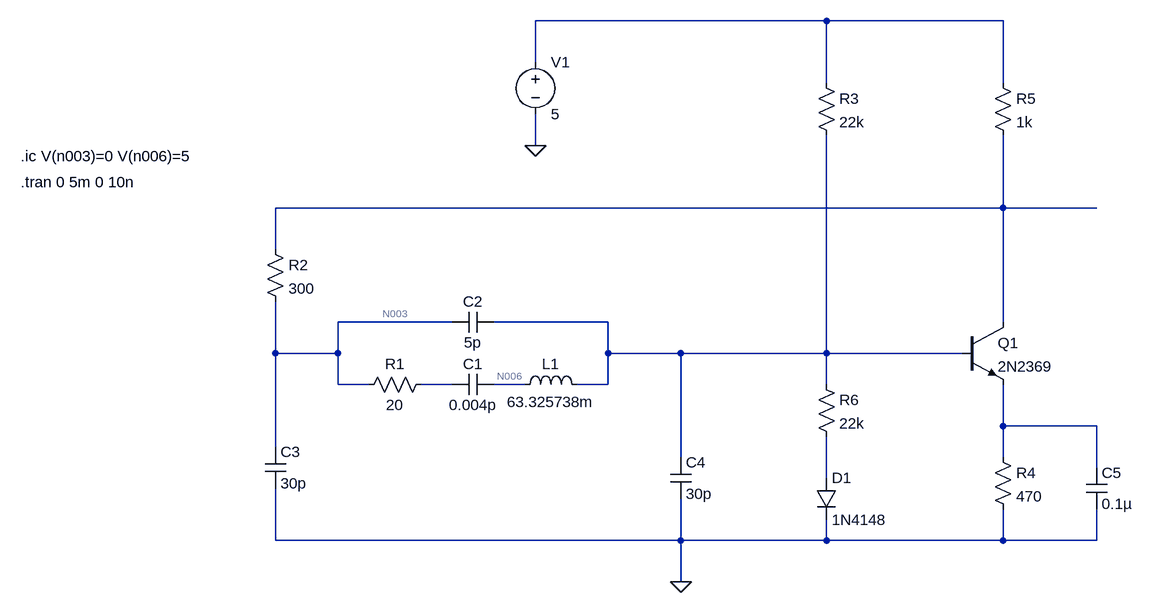
[diagram p0: schematic Pierce_Oscillator.asc]
Pierce_Oscillator.asc, the LTspice schematic file:
Version 4
SHEET 1 1088 680
WIRE 608 -400 160 -400
WIRE 880 -400 608 -400
WIRE 160 -336 160 -400
WIRE 608 -304 608 -400
WIRE 880 -304 880 -400
WIRE 160 -208 160 -256
WIRE 880 -112 880 -224
WIRE 880 -112 -240 -112
WIRE 1024 -112 880 -112
WIRE -240 -48 -240 -112
WIRE 32 64 -144 64
WIRE 272 64 96 64
WIRE 880 64 880 -112
WIRE -240 112 -240 32
WIRE -144 112 -144 64
WIRE -144 112 -240 112
WIRE 272 112 272 64
WIRE 384 112 272 112
WIRE 608 112 608 -224
WIRE 608 112 384 112
WIRE 816 112 608 112
WIRE -144 160 -144 112
WIRE -96 160 -144 160
WIRE 32 160 -16 160
WIRE 144 160 96 160
WIRE 272 160 272 112
WIRE 272 160 224 160
WIRE 608 160 608 112
WIRE 880 224 880 160
WIRE 1024 224 880 224
WIRE -240 256 -240 112
WIRE 384 272 384 112
WIRE 880 272 880 224
WIRE 1024 288 1024 224
WIRE 608 304 608 240
WIRE -240 400 -240 320
WIRE 384 400 384 336
WIRE 384 400 -240 400
WIRE 608 400 608 368
WIRE 608 400 384 400
WIRE 880 400 880 352
WIRE 880 400 608 400
WIRE 1024 400 1024 352
WIRE 1024 400 880 400
WIRE 384 464 384 400
FLAG 160 -208 0
FLAG 384 464 0
SYMBOL cap 96 144 R90
WINDOW 0 0 32 VBottom 2
WINDOW 3 32 32 VTop 2
SYMATTR InstName C1
SYMATTR Value 0.004p
SYMBOL res 0 144 R90
WINDOW 0 0 56 VBottom 2
WINDOW 3 32 56 VTop 2
SYMATTR InstName R1
SYMATTR Value 20
SYMBOL ind 128 176 R270
WINDOW 0 32 56 VTop 2
WINDOW 3 5 56 VBottom 2
SYMATTR InstName L1
SYMATTR Value 63.325738m
SYMBOL cap 96 48 R90
WINDOW 0 0 32 VBottom 2
WINDOW 3 32 32 VTop 2
SYMATTR InstName C2
SYMATTR Value 5p
SYMBOL res -256 -64 R0
SYMATTR InstName R2
SYMATTR Value 300
SYMBOL cap -256 256 R0
SYMATTR InstName C3
SYMATTR Value 30p
SYMBOL cap 368 272 R0
SYMATTR InstName C4
SYMATTR Value 30p
SYMBOL res 592 -320 R0
SYMATTR InstName R3
SYMATTR Value 22k
SYMBOL voltage 160 -352 R0
WINDOW 123 0 0 Left 0
WINDOW 39 0 0 Left 0
SYMATTR InstName V1
SYMATTR Value 5
SYMBOL npn 816 64 R0
SYMATTR InstName Q1
SYMATTR Value 2N2369
SYMBOL res 864 256 R0
SYMATTR InstName R4
SYMATTR Value 470
SYMBOL cap 1008 288 R0
SYMATTR InstName C5
SYMATTR Value 0.1µ
SYMBOL res 864 -320 R0
SYMATTR InstName R5
SYMATTR Value 1k
SYMBOL res 592 144 R0
SYMATTR InstName R6
SYMATTR Value 22k
SYMBOL diode 592 304 R0
SYMATTR InstName D1
SYMATTR Value 1N4148
TEXT -632 -152 Left 2 !.tran 0 5m 0 10n
TEXT -632 -192 Left 2 !.ic V(n003)=0 V(n006)=5

The netlist it stands for:
* Pierce_Oscillator.asc
C1 N006 N005 0.004p
R1 N005 N003 20
L1 N006 N004 63.325738m
C2 N004 N003 5p
R2 N002 N003 300
C3 N003 0 30p
C4 N004 0 30p
R3 N001 N004 22k
V1 N001 0 5
Q1 N002 N004 N007 0 2N2369
R4 N007 0 470
C5 N007 0 0.1µ
R5 N001 N002 1k
R6 N004 N008 22k
D1 N008 0 1N4148
.model D D
.lib standard.dio
.model NPN NPN
.model PNP PNP
.lib standard.bjt
.tran 0 5m 0 10n
.ic V(n003)=0 V(n006)=5
.backanno
.end